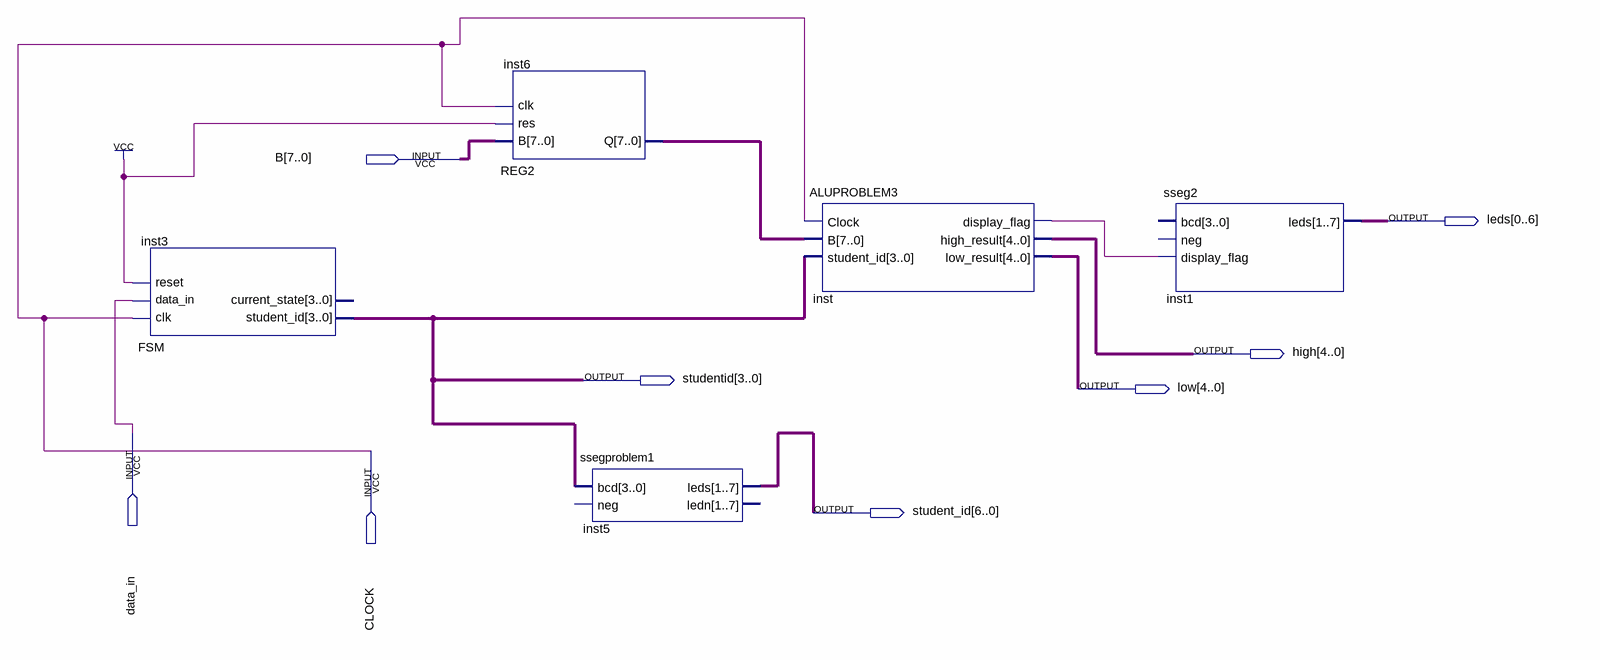
[diagram p0: schematic sheet]
// Quartus schematic PROBLEM3.bdf as structural Verilog: 5 symbols, 8 pins
module PROBLEM3 (
  input  [7:0] B,
  input  data_in,
  input  CLOCK,
  output [0:6] leds,
  output [4:0] high,
  output [3:0] studentid,
  output [4:0] low,
  output [6:0] student_id
);

  wire inst_display_flag;
  wire [7:0] inst6_q;

  FSM inst3 (.clk(CLOCK), .data_in(data_in), .reset(1'b1), .student_id(studentid));  // open: current_state
  REG2 inst6 (.B(B), .res(1'b1), .clk(CLOCK), .Q(inst6_q));
  ssegproblem1 inst5 (.bcd(studentid), .leds(student_id));  // open: neg, ledn
  ALUPROBLEM3 inst (
    .Clock(CLOCK), .B(inst6_q), .student_id(studentid), .display_flag(inst_display_flag), .high_result(high),
    .low_result(low));
  sseg2 inst1 (.display_flag(inst_display_flag), .leds(leds));  // open: bcd, neg
endmodule
